# EAGLE design auxblox (EAGLE 7.6.0)
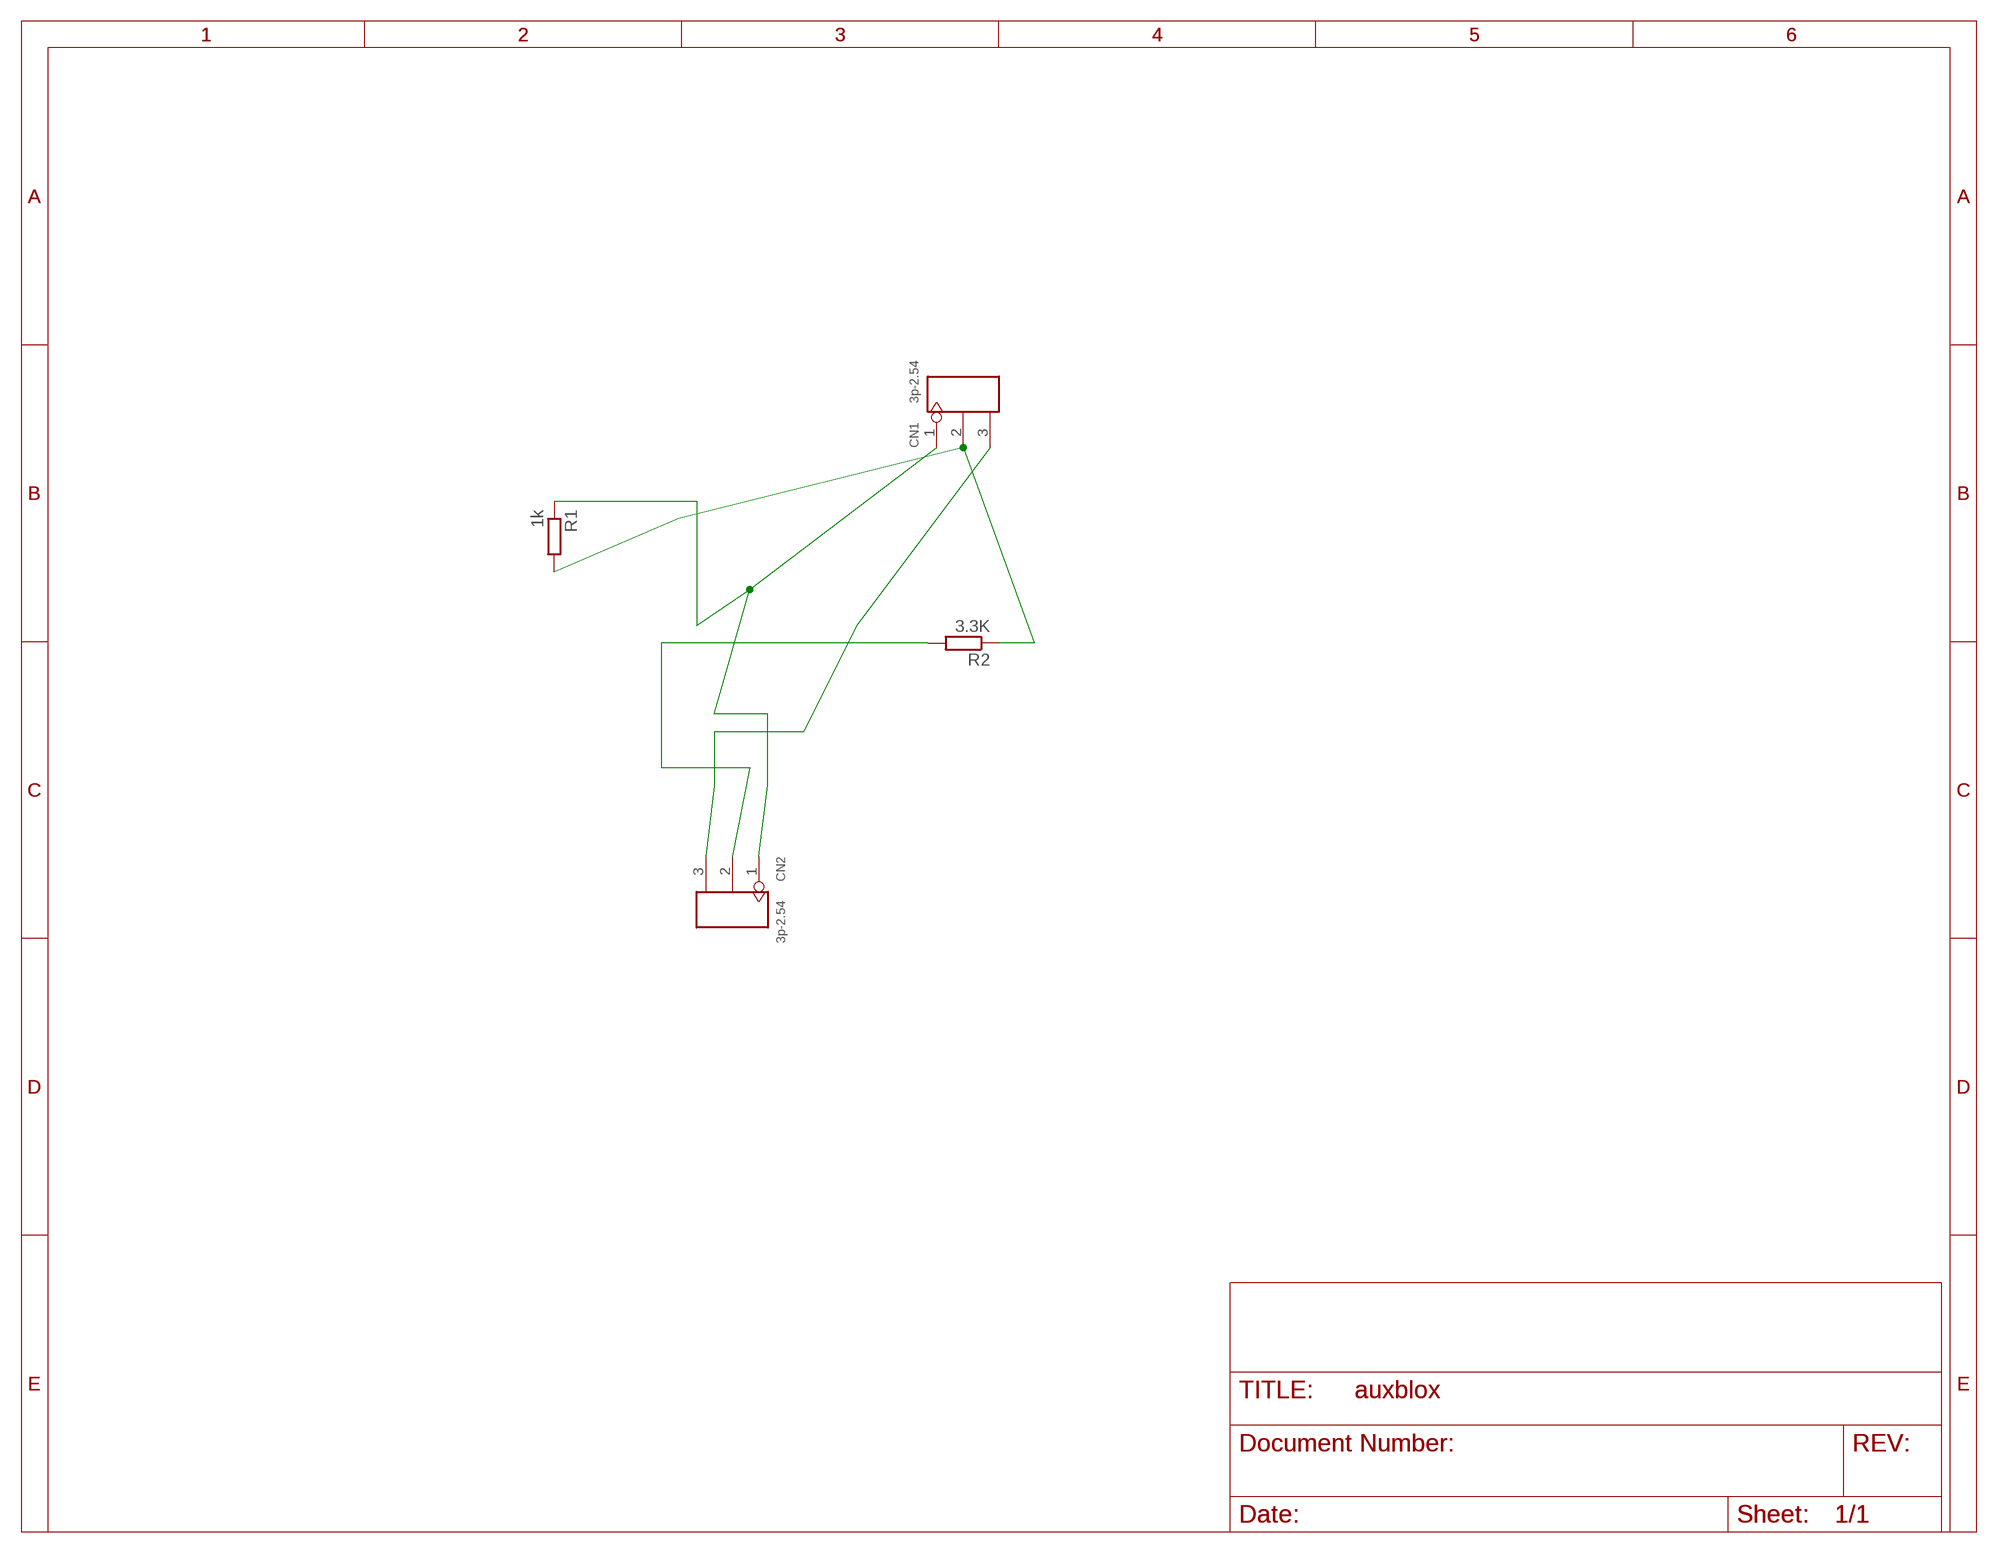
[diagram p0: schematic, sheet 1]

## Parts
CN1  3p-2.54  DIP-BLACK-MALE-HEADER-VERT(3P-2.54)  [H3-2.54]
CN2  3p-2.54  DIP-BLACK-MALE-HEADER-VERT(3P-2.54)  [H3-2.54]
R1  1k  R-EU_R0805  [R0805]
R2  3.3K  R-EU_R0805  [R0805]

## Nets
N$1: CN1.3 CN2.3
N$3: CN2.2 R2.2
N$4: CN1.1 CN2.1 R1.1
N$5: CN1.2 R1.2 R2.1

## Library data of the parts
CN1 CN2 = Seeed-Connector -2016:DIP-BLACK-MALE-HEADER-VERT(3P-2.54): 320020079
R1 R2 = resistor:R-EU_: RESISTOR, European symbol

## Board
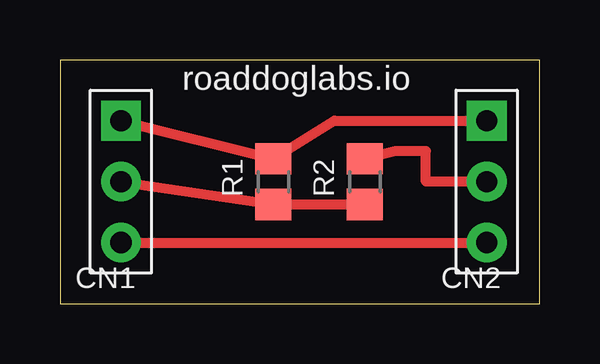
[diagram p1: board, top side]

Size 19.99 x 10.15 mm. Coordinates in mm from the lower left corner, seen from the top.
Outline: 0,0 19.99,0 19.99,10.15 0,10.15 0,0
Copper layers (1*16): Top 0.035mm / dielectric 1.5mm / Bottom 0.035mm
Design rules "dirt_cheap_dirty_boards.v1": minimum track width 5mil, minimum drill 12mil, track to track 5mil, track to pad 5mil, pad to pad 5mil, via to via 5mil, smd to smd 0mil, copper to edge 10mil, drill to drill 10mil, minimum pad ring 10mil, minimum via ring 6mil, stop-mask expansion 2mil, vias tented up to drill 25mil, thermal gap 10mil

### Footprints (pad centres in the part's own frame; a part is rotated, then mirrored left to right if it is on the bottom)
H3-2.54 = drill 0.889 pad 1.651 square: 1 0,2.54 | drill 0.889 pad 1.651: 2 0,0; 3 0,-2.54
R0805 = smd 1.3 x 1.5: 1 -0.95,0; 2 0.95,0

### Placement (x,y rotation side)
CN1  2.54,5.08 0 top
CN2  17.78,5.08 0 top
R1  8.89,5.08 270 top
R2  12.7,5.08 90 top

### Tracks (layer width: path | path; a pad name or v marks a point on that pad's centre or on a via)
N$1
  Top 0.406: CN1.3 CN2.3
N$3
  Top 0.406: CN2.2 15.24,5.08 15.24,6.35 13.97,6.35 R2.2
N$4
  Top 0.406: CN1.1 R1.1 11.43,7.62 CN2.1
N$5
  Top 0.406: CN1.2 R1.2 R2.1

### Text on the board
tPlace: roaddoglabs.io